# Altium schematic sheet HV_gen_rev2.SchDoc
size A3
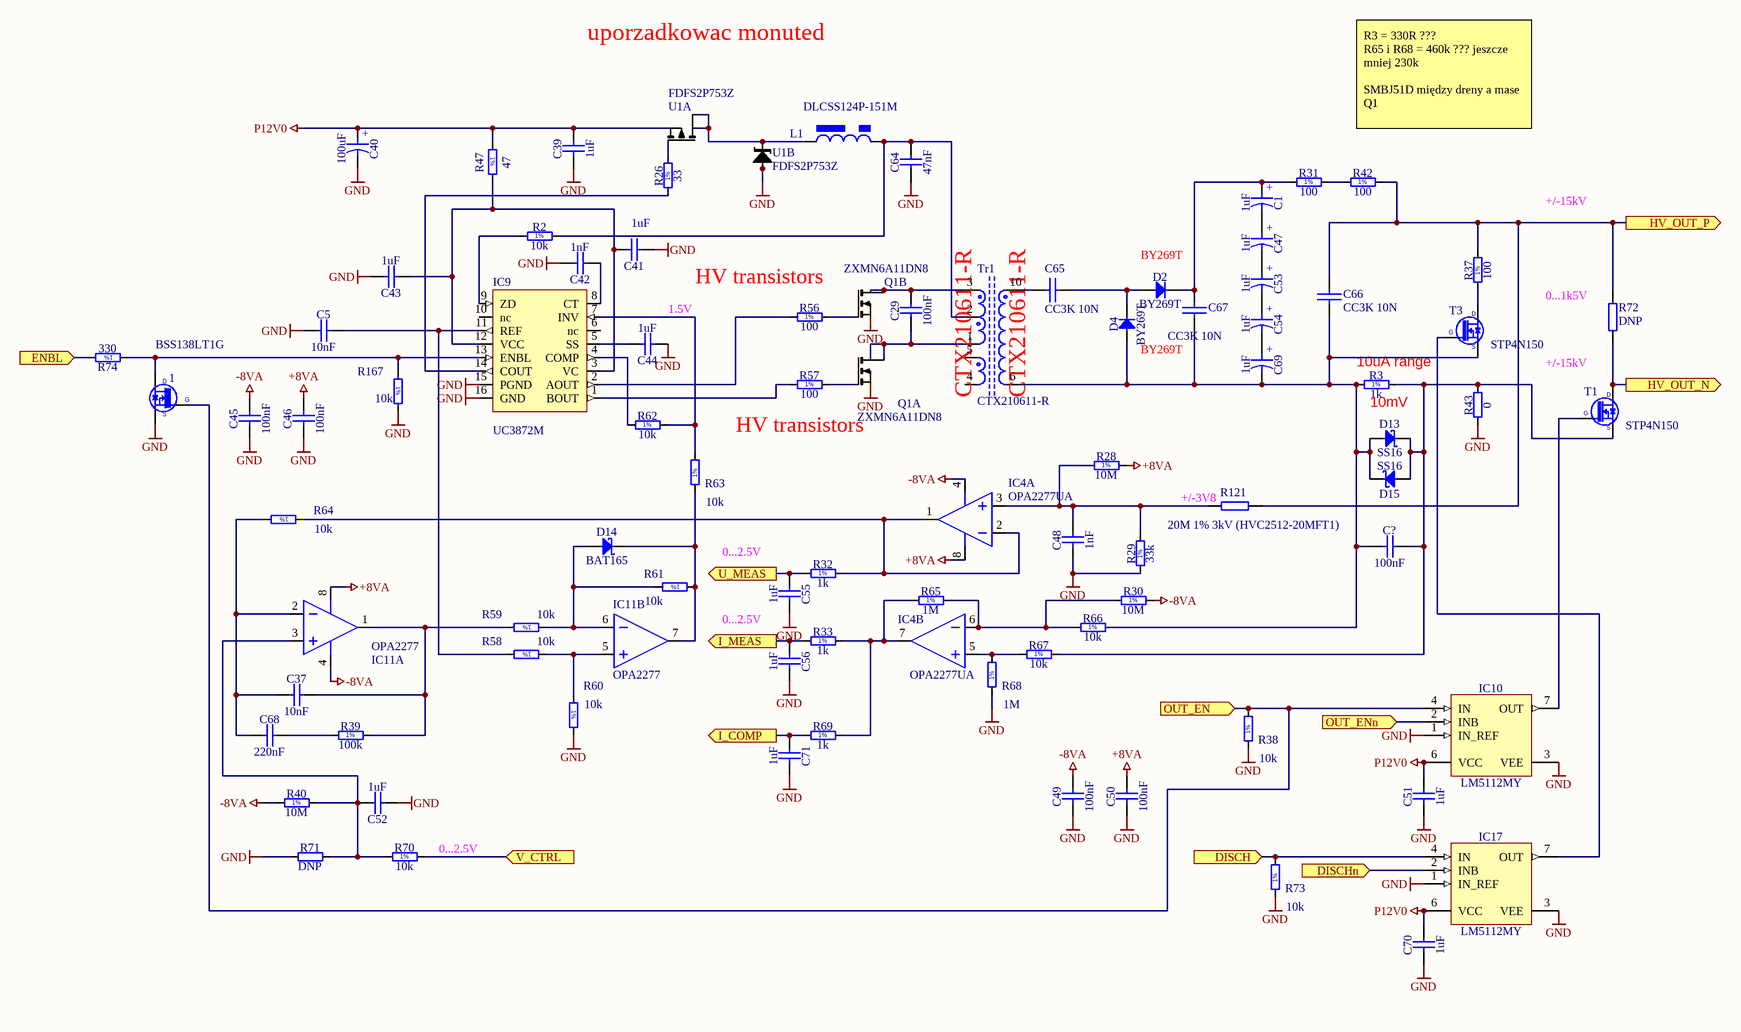
[diagram p0: HV_gen_rev2.SchDoc]

## Parts
1  BSS138LT1G  [SOT95P240X110-3N]
C1  1uF  [CAPPR250-630X1120]
C5  10nF  [CAPC1608X87N]
C29  100nF  [CAPR500-250X720X650]
C37  10nF  [CAPC1608X87N]
C39  1uF  [CAPC1608X87N]
C40  100uF  [CAPAE660X540N]
C41  1uF  [CAPC1608X87N]
C42  1nF  [CAPC1005X55N]
C43  1uF  [CAPC1608X87N]
C44  1uF  [CAPC1608X87N]
C45  100nF  [CAPC1005X55N]
C46  100nF  [CAPC1005X55N]
C47  1uF  [CAPPR250-630X1120]
C48  1nF  [CAPC1005X55N]
C49  100nF  [CAPC1005X55N]
C50  100nF  [CAPC1005X55N]
C51  1uF  [CAPC1608X87N]
C52  1uF  [CAPC1608X87N]
C53  1uF  [CAPPR250-630X1120]
C54  1uF  [CAPPR250-630X1120]
C55  1uF  [CAPC1608X87N]
C56  1uF  [CAPC1608X87N]
C64  47nF  [CAPR500-250X720X650]
C65  CC3K 10N  [CerCapHV_7.5mm]
C66  CC3K 10N  [CerCapHV_7.5mm]
C67  CC3K 10N  [CerCapHV_7.5mm]
C68  220nF  [CAPC1608X87N]
C69  1uF  [CAPPR250-630X1120]
C70  1uF  [CAPC1608X87N]
C71  1uF  [CAPC1608X87N]
C?  100nF  [CAPC1005X55N]
D2  BY269T  [SOD57-LS1016]
D4  BY269T  [SOD57-LS1016]
D13  SS16  [DIOM5127X229N]
D14  BAT165  [SOD2512X110N]
D15  SS16  [DIOM5127X229N]
IC4  OPA2277UA  [SO-8]  (parts A,B of 2)
IC9  UC3872M  [R-PDSO-G16]
IC10  LM5112MY  [SOP65P490X110-9N-R200X185]
IC11  OPA2277  [SO-8]  (parts A,B of 2)
IC17  LM5112MY  [SOP65P490X110-9N-R200X185]
L1  DLCSS124P-151M  [choke_DLCSS124]
Q1  ZXMN6A11DN8  [so-8]  (parts A,B of 2)
R2  10k  [RESC1005X40N]
R3  1k  [RESC1005X40N]
R26  33  [RESC1005X40N]
R28  10M  [RESC1508X63N]
R29  33k  [RESC1005X40N]
R30  10M  [RESC1508X63N]
R31  100  [RESC6331X70N]
R32  1k  [RESC1005X40N]
R33  1k  [RESC1005X40N]
R37  100  [RESC6331X70N]
R38  10k  [RESC1005X40N]
R39  100k  [RESC1608X55N]
R40  10M  [RESC1508X63N]
R42  100  [RESC6331X70N]
R43  0  [RESC1005X40N]
R47  47  [RESC1608X55N]
R56  100  [RESC1005X40N]
R57  100  [RESC1005X40N]
R58  10k  [RESC1005X40N]
R59  10k  [RESC1005X40N]
R60  10k  [RESC1005X40N]
R61  10k  [RESC1005X40N]
R62  10k  [RESC1005X40N]
R63  10k  [RESC1005X40N]
R64  10k  [RESC1005X40N]
R65  1M  [RESC1005X40N]
R66  10k  [RESC1005X40N]
R67  10k  [RESC1005X40N]
R68  1M  [RESC1005X40N]
R69  1k  [RESC1005X40N]
R70  10k  [RESC1005X40N]
R71  DNP  [RESC1608X55N]
R72  DNP  [2512]
R73  10k  [RESC1005X40N]
R74  330  [RESC1005X40N]
R121  20M 1% 3kV (HVC2512-20MFT1)  [2512]
R167  10k  [RESC1005X40N]
T1  STP4N150  [INFINEON_PG-TO-220 FP-h]
T3  STP4N150  [INFINEON_PG-TO-220 FP-h]
Tr1  CTX210611-R  [Tr_PM61300-1-RC]
U1  FDFS2P753Z  [SO-8]  (parts A,B of 2)

## Ports
DISCH (in), DISCHn (in), ENBL (in), HV_OUT_N (out), HV_OUT_P (out), I_COMP (out), I_MEAS (out), OUT_EN (in), OUT_ENn (in), U_MEAS (out), V_CTRL (in)

## Nets
+8VA: C46.2 C50.2 IC4.8(V+) IC11.8(V+) R28.2
-8VA: C45.2 C49.2 IC4.4(V-) IC11.4(V-) R30.2 R40.1
GND: 1.2(S) C5.1 C39.1 C40.2 C41.1 C42.2 C43.2 C44.1 C45.1 C46.1 C48.1 C49.1 C50.1 C51.1 C52.1 C55.2 C56.2 C64.1 C70.1 C71.2 IC9.15(PGND) IC9.16(GND) IC10.1(IN_REF) IC10.3(VEE) IC17.1(IN_REF) IC17.3(VEE) Q1.1(S1) Q1.3(S2) R29.1 R38.1 R43.1 R60.2 R68.1 R71.1 R73.1 R167.2 U1.1(A) U1.2(A)
P12V0: C39.2 C40.1 C51.2 C70.2 IC10.6(VCC) IC17.6(VCC) R47.1 U1.3(S1)
DISCH: IC17.4(IN) R73.2 ; port DISCH
DISCHn: IC17.2(INB) ; port DISCHn
ENBL: R74.2 ; port ENBL
HV_OUT_N: R72.1 T1.2(D) ; port HV_OUT_N
HV_OUT_P: C66.2 R37.2 R42.2 R72.2 R121.2 ; port HV_OUT_P
I_COMP: C71.1 R69.1 ; port I_COMP
I_MEAS: C56.1 R33.1 ; port I_MEAS
OUT_EN: 1.1(G) IC10.4(IN) R38.2 ; port OUT_EN
OUT_ENn: IC10.2(INB) ; port OUT_ENn
U_MEAS: C55.1 R32.1 ; port U_MEAS
V_CTRL: R70.2 ; port V_CTRL
Net1_3: 1.3(D) IC9.13(ENBL) R74.1 R167.1
NetC1_1: C1.1 C67.2 D2.1(C) R31.1
NetC1_2: C1.2 C47.1
NetC5_2: C5.2 IC9.11(REF) R58.2
NetC29_1: C29.1 Q1.7(D1) Q1.8(D1) Tr1.1
NetC29_2: C29.2 Q1.5(D2) Q1.6(D2) Tr1.3
NetC37_1: C37.1 C68.1 IC11.2(IN-) R64.2
NetC37_2: C37.2 IC11.1(OUT) R39.2 R59.2
NetC41_2: C41.2 C43.1 IC9.3(VC) IC9.12(VCC) R47.2
NetC42_1: C42.1 IC9.8(CT)
NetC44_2: C44.2 IC9.5(SS)
NetC47_2: C47.2 C53.1
NetC48_2: C48.2 IC4.3(IN+) R28.1 R29.2 R121.1
NetC52_2: C52.2 IC11.3(IN+) R40.2 R70.1 R71.2
NetC53_2: C53.2 C54.1
NetC54_2: C54.2 C69.1
NetC64_2: C64.2 L1.2 R2.2 Tr1.2
NetC65_1: C65.1 D2.2(A) D4.1(C)
NetC65_2: C65.2 Tr1.10
NetC66_1: C66.1 C67.1 C69.2 C?.1 D4.2(A) D13.2(A) D15.1(C) R3.1 R66.2 T3.3(S) Tr1.6
NetC68_2: C68.2 R39.1
NetC?_2: C?.2 D13.1(C) D15.2(A) R3.2 R43.2 R67.2 T1.3(S)
NetD14_1: D14.1(C) IC11.7(OUT) R61.1 R63.1
NetD14_2: D14.2(A) IC11.6(IN-) R59.1 R61.2
NetIC4_1: IC4.1(OUT) IC4.2(IN-) R32.2 R64.1
NetIC4_5: IC4.5(IN+) R67.1 R68.2
NetIC4_6: IC4.6(IN-) R30.1 R65.2 R66.1
NetIC4_7: IC4.7(OUT) R33.2 R65.1 R69.2
NetIC9_1: IC9.1(BOUT) R57.1
NetIC9_2: IC9.2(AOUT) R56.1
NetIC9_4: IC9.4(COMP) R62.1
NetIC9_7: IC9.7(INV) R62.2 R63.2
NetIC9_9: IC9.9(ZD) R2.1
NetIC9_14: IC9.14(COUT) R26.1
NetIC10_7: IC10.7(OUT) T1.1(G)
NetIC11_5: IC11.5(IN+) R58.1 R60.1
NetIC17_7: IC17.7(OUT) T3.1(G)
NetL1_1: L1.1 U1.5(D1) U1.6(D1) U1.7(K) U1.8(K)
NetQ1_2: Q1.2(G1) R57.2
NetQ1_4: Q1.4(G2) R56.2
NetR26_2: R26.2 U1.4(G1)
NetR31_2: R31.2 R42.1
NetR37_1: R37.1 T3.2(D)

Not connected (* = marked no-connect by the designer): IC9 6(nc) 10(nc); Tr1 4 5

## Notes on the sheet
- uporzadkowac monuted
- R3 = 330R ???
  R65 i R68 = 460k ??? jeszcze mniej 230k
  SMBJ51D między dreny a mase Q1
- BY269T
- +/-15kV
- (near C44) 1.5V
- (near Q1) HV transistors
- (near R72) 0...1k5V
- (near Tr1) CTX210611-R
- (near R3) 10uA range
- HV transistors
- (near R3) 10mV
- (near R121) +/-3V8
- 0...2.5V
- (near R70) 0...2.5V
- (in symbol CAE660-540_100UF_16V_20%) +
- (in symbol CAP_ELECTRO_1u/450V) +
- (in symbol R0402_1K_1%_0.0625W_100PPM) 1%
- (in symbol R0402_1M_1%_0.0625W_100PPM) 1%
- (in symbol R0402_10K_1%_0.0625W_100PPM) 1%
- (in symbol R0402_33K_1%_0.0625W_100PPM) 1%
- (in symbol R0402_33R_1%_0.0625W_100PPM) 1%
- (in symbol R0402_100R_1%_0.0625W_100PPM) 1%
- (in symbol R0402_330R_1%_0.0625W_100PPM) 1%
- (in symbol R0603_10M_1%_0.125W_100PPM_VISHAY_CHP) 1%
- (in symbol R0603_47R_1%_0.1W_100PPM) 1%
- (in symbol R0603_100K_1%_0.1W_100PPM) 1%
- (in symbol R2512_100R_1%_1.5W_100PPM_VISHAY_CRCW-HP e3) 1%

## Library data of the parts
1 = BSS138LT1G: N-CHANNEL MOSFET WITH DIODE; Part Description: 50V 200mA N-Channel Enhancement Mode Field-Effect Transistor; Manufacturer: ON SEMICONDUCTOR; PressFit: No; Bonding: No; Part Number: BSS138LT1G; Component Kind: Standard; Component Type: Standard; Device: BSS138LT1G; PackageDescription: SOT23 3-Leads, Pitch 0.95mm - Body 1.4x3mm, IPC Medium Density; Manufacturer Part Number: BSS138LT1G; Pin Count: 3; Case: SOT23-3; Mounted: Yes; Socket: No; SMD: Yes; Sense: No; ComponentHeight: 1.11mm; HelpURL: \\cern.ch\dfs\Applications\Altium\Datasheets\BSS138LT1G.pdf; Author: CERN DEM JLC; CreateDate: 2009-03-23; LatestRevisionDate: 2009-03-23
C1 C47 C53 C54 C69 = CAP_ELECTRO_1u/450V: Polarised capacitor; Part Number: CAER_1UF_450V_20%_250-630X1120; Part Description: Aluminum Electrolytic Capacitor; Manufacturer: GENERIC; Manufacturer1 Part Number: EKM105M2WE11RRSHP; Voltage: 450V; Tolerance: ±20%; Component Kind: Standard; Component Type: Standard; Pin Count: 2; Value: 1uF; Status: Preferred; Manufacturer Part Number: CAER_1UF_450V_20%_250-630X1120; Case: LS2.5 D6.3 x H11.2; Mounted: Yes; Socket: No; SMD: No; Sense: No; ComponentHeight: 11.2mm; Manufacturer1 Example: SAMXON; Manufacturer1 ComponentHeight: 11.2mm; HelpURL: \\cern.ch\dfs\Applications\Altium\Datasheets\CAER_PANASONIC_FC.pdf; Author: GK; CreateDate: 2016-05-28; LatestRevisionDate: 2016-05-28
C5 C37 = CC0603_10NF_50V_5%_C0G: Non-polarised capacitor; Part Description: SMD Multilayer Chip Ceramic Capacitor; Manufacturer: GENERIC; Manufacturer1 Part Number: C1608C0G1H103J080AA; Voltage: 50V; TC: C0G/NP0; Tolerance: ±5%; Part Number: CC0603_10NF_50V_5%_C0G; Component Kind: Standard; Component Type: Standard; Pin Count: 2; Value: 10nF; Status: Preferred; Manufacturer Part Number: CC0603_10NF_50V_5%_C0G; Case: 0603; Mounted: Yes; Socket: No; SMD: Yes; Sense: No; Manufacturer1 Example: TDK; Manufacturer1 ComponentHeight: 0.9mm; HelpURL: \\cern.ch\dfs\Applications\Altium\Datasheets\CC0603_C0G_TDK_C.pdf; Author: CERN DEM JLC; CreateDate: 2014-12-10; LatestRevisionDate: 2014-12-10
C29 = CPER_100NF_100V_10%_500-250X720X650: Non-polarised capacitor; Part Description: Metallized Polyester Film Capacitor (MKT); Manufacturer: TDK; Manufacturer Part Number: B32529C1104K000; Voltage: 100VDC/63VAC; Tolerance: ±10%; Part Number: CPER_100NF_100V_10%_500-250X720X650; Component Kind: Standard; Component Type: Standard; Pin Count: 2; Value: 100nF; Status: None; Case: LS5 W2.5 x L7.2 x H6.5; Mounted: Yes; Socket: No; SMD: No; Sense: No; ComponentHeight: 6.5mm; HelpURL: \\cern.ch\dfs\Applications\Altium\Datasheets\CPER_TDK_B32529.pdf; Author: CERN DEM JLC; CreateDate: 2010-03-22; LatestRevisionDate: 2015-04-22
C39 C41 C43 C44 C51 C52 C55 C56 C70 C71 = CC0603_1UF_25V_10%_X7R: Non-polarised capacitor; Part Description: SMD Multilayer Chip Ceramic Capacitor; Manufacturer: GENERIC; Manufacturer1 Part Number: GRM188R71E105KA12D; Voltage: 25V; TC: X7R; Tolerance: ±10%; Part Number: CC0603_1UF_25V_10%_X7R; Component Kind: Standard; Component Type: Standard; Pin Count: 2; Value: 1uF; Status: None; Manufacturer Part Number: CC0603_1UF_25V_10%_X7R; Case: 0603; Mounted: Yes; Socket: No; SMD: Yes; Sense: No; Manufacturer1 Example: MURATA; Manufacturer1 ComponentHeight: 0.9mm; HelpURL: \\cern.ch\dfs\Applications\Altium\Datasheets\CC0603_X7R_MURATA.pdf; Author: CERN DEM JLC; CreateDate: 2011-01-18; LatestRevisionDate: 2011-01-18
C40 = CAE660-540_100UF_16V_20%: Polarised capacitor; Part Description: Aluminum Electrolytic SMT Capacitor; Manufacturer: PANASONIC; Manufacturer Part Number: EEEFK1C101AP; Voltage: 16V; Tolerance: ±20%; Part Number: CAE660-540_100UF_16V_20%; Component Kind: Standard; Component Type: Standard; Pin Count: 2; Value: 100uF; Status: Not Recommended; Case: D; Mounted: Yes; Socket: No; SMD: Yes; Sense: No; ComponentHeight: 5.8mm; HelpURL: \\cern.ch\dfs\Applications\Altium\Datasheets\CAE_PANASONIC_FK.pdf; Author: CERN DEM JLC; CreateDate: 2007-12-03; LatestRevisionDate: 2014-11-05
C42 C48 = CC0402_1NF_50V_10%_X7R: Non-polarised capacitor; Part Description: SMD Multilayer Chip Ceramic Capacitor; Manufacturer: GENERIC; Manufacturer1 Part Number: 223858715623; Voltage: 50V; TC: X7R; Tolerance: ±10%; Part Number: CC0402_1NF_50V_10%_X7R; Component Kind: Standard; Component Type: Standard; Pin Count: 2; Value: 1nF; Status: Not Recommended; Manufacturer Part Number: CC0402_1NF_50V_10%_X7R; Case: 0402; Mounted: Yes; Socket: No; SMD: Yes; Sense: No; Manufacturer1 Example: PHYCOMP; Manufacturer1 ComponentHeight: 0.55mm; HelpURL: \\cern.ch\dfs\Applications\Altium\Datasheets\CC0402_X7R_PHYCOMP.pdf; Author: CERN DEM JLC; CreateDate: 2007-12-03; LatestRevisionDate: 2007-12-03
C45 C46 C49 C50 C? = CC0402_100NF_16V_10%_X7R: Non-polarised capacitor; Part Description: SMD Multilayer Chip Ceramic Capacitor; Manufacturer: GENERIC; Manufacturer1 Part Number: GRM155R71C104KA88D; Voltage: 16V; TC: X7R; Tolerance: ±10%; Part Number: CC0402_100NF_16V_10%_X7R; Component Kind: Standard; Component Type: Standard; Pin Count: 2; Value: 100nF; Status: Not Recommended; Manufacturer Part Number: CC0402_100NF_16V_10%_X7R; Case: 0402; Mounted: Yes; Socket: No; SMD: Yes; Sense: No; Manufacturer1 Example: MURATA; Manufacturer1 ComponentHeight: 0.55mm; HelpURL: \\cern.ch\dfs\Applications\Altium\Datasheets\CC0402_X7R_MURATA_GRM.pdf; Author: CERN DEM JLC; CreateDate: 2013-12-05; LatestRevisionDate: 2007-12-03
C64 = CPER_47NF_63V_10%_500-250X720X650: Non-polarised capacitor; Part Description: Metallized Polyester Film Capacitor (MKT); Manufacturer: TDK; Manufacturer Part Number: B32529C0473K000; Voltage: 63VDC/40VAC; Tolerance: ±10%; Part Number: CPER_47NF_63V_10%_500-250X720X650; Component Kind: Standard; Component Type: Standard; Pin Count: 2; Value: 47nF; Status: None; Case: LS5 W2.5 x L7.2 x H6.5; Mounted: Yes; Socket: No; SMD: No; Sense: No; ComponentHeight: 6.5mm; HelpURL: \\cern.ch\dfs\Applications\Altium\Datasheets\CPER_TDK_B32529.pdf; Author: CERN DEM JLC; CreateDate: 2007-12-19; LatestRevisionDate: 2015-04-22
C65-C67 = CAP_RADIAL: Capacitor
C68 = CC0603_220NF_10V_10%_X7R: Non-polarised capacitor; Part Description: SMD Multilayer Chip Ceramic Capacitor; Manufacturer: GENERIC; Manufacturer1 Part Number: 223824615654 or CC0603KRX7R6BB224; Voltage: 10V; TC: X7R; Tolerance: ±10%; Part Number: CC0603_220NF_10V_10%_X7R; Component Kind: Standard; Component Type: Standard; Pin Count: 2; Value: 220nF; Status: Preferred; Manufacturer Part Number: CC0603_220NF_10V_10%_X7R; Case: 0603; Mounted: Yes; Socket: No; SMD: Yes; Sense: No; Manufacturer1 Example: YAGEO PHYCOMP; Manufacturer1 ComponentHeight: 0.9mm; HelpURL: \\cern.ch\dfs\Applications\Altium\Datasheets\CC0603_X7R_PHYCOMP.pdf; Author: CERN DEM JLC; CreateDate: 2012-10-25; LatestRevisionDate: 2012-10-25
D2 D4 = BY527: Diode; Part Description: Standard Avalanche Sinterglass Diode; Manufacturer: VISHAY SEMICONDUCTORS; Voltage: 800V; Power: 2A; PressFit: No; Bonding: No; Part Number: BY269T; Component Kind: Standard; Component Type: Standard; Device: BY269T; PackageDescription: Diode Case SOD57,  Axial, Body L 4.57 x D 3.81 mm , Pin spacing 10.16mm; Manufacturer Part Number: BY269T; Pin Count: 2; Case: SOD57; Mounted: Yes; Socket: No; SMD: No; Sense: No; ComponentHeight: 3.6mm; HelpURL: \\cern.ch\dfs\Applications\Altium\Datasheets\BY527.pdf; Author: CERN DEM JLC; CreateDate: 2009-02-19; LatestRevisionDate: 2010-04-21
D13 D15 = SS16: Schottky Diode; Part Description: Surface Mount Schottky Barrier Rectifier; Manufacturer: VISHAY GENERAL SEMICONDUCTOR; Voltage: 60V; Power: 1A; PressFit: No; Bonding: No; Part Number: SS16; Component Kind: Standard; Component Type: Standard; Device: SS16; PackageDescription: DO-214-AC Molded Diode, Body 5.1x2.7mm, IPC Medium Density; Manufacturer Part Number: SS16; Pin Count: 2; Case: DO-214AC; Mounted: Yes; Socket: No; SMD: Yes; Sense: No; ComponentHeight: 2.29mm; HelpURL: \\cern.ch\dfs\Applications\Altium\Datasheets\SS16.pdf; Author: CERN DEM JLC; CreateDate: 2008-07-15; LatestRevisionDate: 2010-08-23
D14 = BAT165: Schottky Diode; Part Description: Medium Power AF Schottky Diode; Manufacturer: INFINEON; Voltage: 40V; Power: 750mA; PressFit: No; Bonding: No; Part Number: BAT165; Component Kind: Standard; Component Type: Standard; Device: BAT165; PackageDescription: Small Outline Diode Flat Lead (SOD-323), 1.70mm W X 1.25mm L X 1.10mm H body,  IPC Medium Density; Manufacturer Part Number: BAT165; Pin Count: 2; Case: SOD323; Mounted: Yes; Socket: No; SMD: Yes; Sense: No; ComponentHeight: 1.1mm; HelpURL: \\cern.ch\dfs\Applications\Altium\Datasheets\BAT165.pdf; Author: CERN DEM JLC; CreateDate: 2014-11-12; LatestRevisionDate: 2014-11-12
IC4 IC11 = OA_OPA2277: precision 36V Operational Amplifier (TME)
  IC4: Device: OPA2277UA
IC9 = UC3872: Resonant Lamp Ballast Controller
IC10 IC17 = LM5112MY: Tiny 7A MOSFET Gate Driver; Manufacturer: NATIONAL SEMICONDUCTOR; PressFit: No; Bonding: No; Part Number: LM5112MY; Component Kind: Standard; Component Type: Standard; Device: LM5112MY; PackageDescription: SOP, 8-Leads, Body 3x3mm (max), Pitch 0.65mm, (w/thermal tab 2 .00 X 1.85 mm), IPC Medium Density; Part Description: Tiny 7A MOSFET Gate Driver; Manufacturer Part Number: LM5112MY; Pin Count: 8; Case: MSOP8; Mounted: Yes; Socket: No; SMD: Yes; Sense: No; ComponentHeight: 1.1mm; Author: CERN DEM JLC; HelpURL: \\cern.ch\dfs\Applications\Altium\Datasheets\LM5112MY.pdf; CreateDate: 2008-11-25; LatestRevisionDate: 2009-09-14
L1 = L_POWER_INDUCTOR_CSS124: inductor
Q1 = Q_FDS8949: dual NMOS 40V, 6A, 29mR
R2 R38 R58-R64 R66 R67 R70 R73 R167 = R0402_10K_1%_0.0625W_100PPM: Resistor - 1%; Part Description: General Purpose Thick Film Chip Resistor; Manufacturer: GENERIC; Manufacturer1 Part Number: 232270671003L; TC: ±100ppm/°C; Part Number: R0402_10K_1%_0.0625W_100PPM; Component Kind: Standard; Component Type: Standard; Pin Count: 2; Value: 10k; Status: Not recommended; Power: 0.0625W; Tolerance: ±1%; Manufacturer Part Number: R0402_10K_1%_0.0625W_100PPM; Case: 0402; Mounted: Yes; Sense: No; Socket: No; SMD: Yes; Manufacturer1 Example: YAGEO PHYCOMP; Manufacturer1 ComponentHeight: 0.4mm; HelpURL: \\cern.ch\dfs\Applications\Altium\Datasheets\R0402_Phycomp_RC0402.pdf; Author: CERN DEM JLC; CreateDate: 2007-12-03; LatestRevisionDate: 2012-10-17
R3 R32 R33 R69 = R0402_1K_1%_0.0625W_100PPM: Resistor - 1%; Part Description: General Purpose Thick Film Chip Resistor; Manufacturer: GENERIC; Manufacturer1 Part Number: 232270671002L; TC: ±100ppm/°C; Part Number: R0402_1K_1%_0.0625W_100PPM; Component Kind: Standard; Component Type: Standard; Pin Count: 2; Value: 1k; Status: Not recommended; Power: 0.0625W; Tolerance: ±1%; Manufacturer Part Number: R0402_1K_1%_0.0625W_100PPM; Case: 0402; Mounted: Yes; Sense: No; Socket: No; SMD: Yes; Manufacturer1 Example: YAGEO PHYCOMP; Manufacturer1 ComponentHeight: 0.4mm; HelpURL: \\cern.ch\dfs\Applications\Altium\Datasheets\R0402_Phycomp_RC0402.pdf; Author: CERN DEM JLC; CreateDate: 2007-12-03; LatestRevisionDate: 2012-10-17
R26 = R0402_33R_1%_0.0625W_100PPM: Resistor - 1%; Part Description: General Purpose Thick Film Chip Resistor; Manufacturer: GENERIC; Manufacturer1 Part Number: 232270673309L; TC: ±100ppm/°C; Part Number: R0402_33R_1%_0.0625W_100PPM; Component Kind: Standard; Component Type: Standard; Pin Count: 2; Value: 33; Status: Not recommended; Power: 0.0625W; Tolerance: ±1%; Manufacturer Part Number: R0402_33R_1%_0.0625W_100PPM; Case: 0402; Mounted: Yes; Sense: No; Socket: No; SMD: Yes; Manufacturer1 Example: YAGEO PHYCOMP; Manufacturer1 ComponentHeight: 0.4mm; HelpURL: \\cern.ch\dfs\Applications\Altium\Datasheets\R0402_Phycomp_RC0402.pdf; Author: CERN DEM JLC; CreateDate: 2007-12-03; LatestRevisionDate: 2012-10-17
R28 R30 R40 = R0603_10M_1%_0.125W_100PPM_VISHAY_CHP: Resistor - 1%; Part Description: High Stability Metal Glaze Thick Film Chip Resistor; Manufacturer: VISHAY SFERNICE; Manufacturer Part Number: CHP0603K1005FNT; Power: 0.125W; TC: ±100ppm/°C; Part Number: R0603_10M_1%_0.125W_100PPM_VISHAY_CHP; Component Kind: Standard; Component Type: Standard; Pin Count: 2; Value: 10M; Status: None; Tolerance: ±1%; Case: 0603; Mounted: Yes; Sense: No; Socket: No; SMD: Yes; ComponentHeight: 0.63mm; HelpURL: \\cern.ch\dfs\Applications\Altium\Datasheets\R0603_VISHAY_CHP.pdf; Author: CERN DEM JLC; CreateDate: 2011-06-22; LatestRevisionDate: 2011-06-22
R29 = R0402_33K_1%_0.0625W_100PPM: Resistor - 1%; Part Description: General Purpose Thick Film Chip Resistor; Manufacturer: GENERIC; Manufacturer1 Part Number: 232270673303L; TC: ±100ppm/°C; Part Number: R0402_33K_1%_0.0625W_100PPM; Component Kind: Standard; Component Type: Standard; Pin Count: 2; Value: 33k; Status: Not recommended; Power: 0.0625W; Tolerance: ±1%; Manufacturer Part Number: R0402_33K_1%_0.0625W_100PPM; Case: 0402; Mounted: Yes; Sense: No; Socket: No; SMD: Yes; Manufacturer1 Example: YAGEO PHYCOMP; Manufacturer1 ComponentHeight: 0.4mm; HelpURL: \\cern.ch\dfs\Applications\Altium\Datasheets\R0402_Phycomp_RC0402.pdf; Author: CERN DEM JLC; CreateDate: 2007-12-03; LatestRevisionDate: 2012-10-17
R31 R37 R42 = R2512_100R_1%_1.5W_100PPM_VISHAY_CRCW-HP e3: Resistor - 1%; Part Description: Pulse Proof, High Power Thick Film Chip Resistor; Manufacturer: VISHAY DRALORIC; Manufacturer Part Number: CRCW2512100RFKEHHP; Power: 1.5W; TC: ±100ppm/°C; Voltage: 500V; Part Number: R2512_100R_1%_1.5W_100PPM_VISHAY_CRCW-HP e3; Component Kind: Standard; Component Type: Standard; Pin Count: 2; Value: 100; Status: None; Tolerance: ±1%; Case: 2512; Mounted: Yes; Sense: No; Socket: No; SMD: Yes; ComponentHeight: 0.7mm; HelpURL: \\cern.ch\dfs\Applications\Altium\Datasheets\R2512_VISHAY_CRCW-HP e3.pdf; Author: CERN DEM JLC; CreateDate: 2013-05-21; LatestRevisionDate: 2013-05-21
R39 = R0603_100K_1%_0.1W_100PPM: Resistor - 1%; Part Description: General Purpose Thick Film Chip Resistor; Manufacturer: GENERIC; Manufacturer1 Part Number: NRC06F1003TRF; Power: 0.1W; TC: ±100ppm/°C; Part Number: R0603_100K_1%_0.1W_100PPM; Component Kind: Standard; Component Type: Standard; Pin Count: 2; Value: 100k; Status: Preferred; Tolerance: ±1%; Manufacturer Part Number: R0603_100K_1%_0.1W_100PPM; Case: 0603; Mounted: Yes; Sense: No; Socket: No; SMD: Yes; Manufacturer1 Example: NIC COMPONENT; Manufacturer1 ComponentHeight: 0.55mm; HelpURL: \\cern.ch\dfs\Applications\Altium\Datasheets\R0603_NIC_NRC.pdf; Author: CERN DEM JLC; CreateDate: 2007-12-03; LatestRevisionDate: 2008-03-13
R43 = R0402_0R_JUMPER: Resistor; Part Description: 1A (0.05R Max DC Resistance) Zero Ohm Jumper; Manufacturer: GENERIC; Manufacturer1 Part Number: 232270591001L; Part Number: R0402_0R_JUMPER; Component Kind: Standard; Component Type: Standard; Pin Count: 2; Value: 0; Status: Not recommended; Manufacturer Part Number: R0402_0R_JUMPER; Case: 0402; Mounted: Yes; Sense: No; Socket: No; SMD: Yes; Manufacturer1 Example: YAGEO PHYCOMP; Manufacturer1 ComponentHeight: 0.4mm; HelpURL: \\cern.ch\dfs\Applications\Altium\Datasheets\R0402_Phycomp_RC0402.pdf; Author: CERN DEM JLC; CreateDate: 2007-12-03; LatestRevisionDate: 2012-10-17
R47 = R0603_47R_1%_0.1W_100PPM: Resistor - 1%; Part Description: General Purpose Thick Film Chip Resistor; Manufacturer: GENERIC; Manufacturer1 Part Number: NRC06F47R0TRF; Power: 0.1W; TC: ±100ppm/°C; Part Number: R0603_47R_1%_0.1W_100PPM; Component Kind: Standard; Component Type: Standard; Pin Count: 2; Value: 47; Status: Preferred; Tolerance: ±1%; Manufacturer Part Number: R0603_47R_1%_0.1W_100PPM; Case: 0603; Mounted: Yes; Sense: No; Socket: No; SMD: Yes; Manufacturer1 Example: NIC COMPONENT; Manufacturer1 ComponentHeight: 0.55mm; HelpURL: \\cern.ch\dfs\Applications\Altium\Datasheets\R0603_NIC_NRC.pdf; Author: CERN DEM JLC; CreateDate: 2007-12-03; LatestRevisionDate: 2008-03-13
R56 R57 = R0402_100R_1%_0.0625W_100PPM: Resistor - 1%; Part Description: General Purpose Thick Film Chip Resistor; Manufacturer: GENERIC; Manufacturer1 Part Number: 232270671001L; TC: ±100ppm/°C; Part Number: R0402_100R_1%_0.0625W_100PPM; Component Kind: Standard; Component Type: Standard; Pin Count: 2; Value: 100; Status: Not recommended; Power: 0.0625W; Tolerance: ±1%; Manufacturer Part Number: R0402_100R_1%_0.0625W_100PPM; Case: 0402; Mounted: Yes; Sense: No; Socket: No; SMD: Yes; Manufacturer1 Example: YAGEO PHYCOMP; Manufacturer1 ComponentHeight: 0.4mm; HelpURL: \\cern.ch\dfs\Applications\Altium\Datasheets\R0402_Phycomp_RC0402.pdf; Author: CERN DEM JLC; CreateDate: 2007-12-03; LatestRevisionDate: 2012-10-17
R65 R68 = R0402_1M_1%_0.0625W_100PPM: Resistor - 1%; Part Description: General Purpose Thick Film Chip Resistor; Manufacturer: GENERIC; Manufacturer1 Part Number: 232270671005L; TC: ±100ppm/°C; Part Number: R0402_1M_1%_0.0625W_100PPM; Component Kind: Standard; Component Type: Standard; Pin Count: 2; Value: 1M; Status: Not recommended; Power: 0.0625W; Tolerance: ±1%; Manufacturer Part Number: R0402_1M_1%_0.0625W_100PPM; Case: 0402; Mounted: Yes; Sense: No; Socket: No; SMD: Yes; Manufacturer1 Example: YAGEO PHYCOMP; Manufacturer1 ComponentHeight: 0.4mm; HelpURL: \\cern.ch\dfs\Applications\Altium\Datasheets\R0402_Phycomp_RC0402.pdf; Author: CERN DEM JLC; CreateDate: 2007-12-03; LatestRevisionDate: 2012-10-17
R71 = R0603_NO-VALUE: Resistor; Part Description: Reserved Footprint For a 0603 (1608) Chip Resistor; Value: Undefined; Mounted: No; Part Number: R0603_NO-VALUE; Component Kind: Standard; Component Type: Standard; Pin Count: 2; Status: None; Manufacturer: Undefined; Manufacturer Part Number: R0603_NO-VALUE; Case: 0603; Sense: No; Socket: No; SMD: Yes; Manufacturer1 Example: Undefined; Manufacturer1 Part Number: Undefined; Manufacturer1 ComponentHeight: Undefined; HelpURL: Undefined; Author: CERN DEM JLC; CreateDate: 2007-12-03; LatestRevisionDate: 2008-03-13
R72 R121 = RES_SMD_POW: 1W SMD Resistor (TME)
R74 = R0402_330R_1%_0.0625W_100PPM: Resistor - 1%; Part Description: General Purpose Thick Film Chip Resistor; Manufacturer: GENERIC; Manufacturer1 Part Number: 232270673301L; TC: ±100ppm/°C; Part Number: R0402_330R_1%_0.0625W_100PPM; Component Kind: Standard; Component Type: Standard; Pin Count: 2; Value: 330; Status: Not recommended; Power: 0.0625W; Tolerance: ±1%; Manufacturer Part Number: R0402_330R_1%_0.0625W_100PPM; Case: 0402; Mounted: Yes; Sense: No; Socket: No; SMD: Yes; Manufacturer1 Example: YAGEO PHYCOMP; Manufacturer1 ComponentHeight: 0.4mm; HelpURL: \\cern.ch\dfs\Applications\Altium\Datasheets\R0402_Phycomp_RC0402.pdf; Author: CERN DEM JLC; CreateDate: 2007-12-03; LatestRevisionDate: 2012-10-17
T1 T3 = Q_STP4N150: N-CHANNEL MOSFET  1.5kV 4A, 160W; Part Description: 1500V 4A N-Channel  Power Transistor; Manufacturer: ST MICROELECTRONICS; PressFit: No; Bonding: No; Part Number: STP4N150; Component Kind: Standard; Component Type: Standard; Device: STP4N150; PackageDescription: TO-220 3-Terminal Outline/Fully Isolated package (2500VAC; 1minute) - Horizontal Mount; Manufacturer Part Number: STP4N150; Pin Count: 3; Case: TO-220; Mounted: Yes; Socket: No; SMD: No; Sense: No; ComponentHeight: 4.85mm; HelpURL: \\cern.ch\dfs\Applications\Altium\Datasheets\IPA90R340C3.pdf; Author: GK; CreateDate: 2016-05-28; LatestRevisionDate: 2014-10-20
Tr1 = Tr_CCFL_PM61300-5-RC: SMD CCFL Transformer (Farnell, Mouser); Device: CTX210611-R; Manufacturer Part Number: CTX210611-R
U1 = Q_FDFS2P753Z: Integrated P-Channel and Schottky Diode -30V, -3A, 115mR